# Altium schematic sheet Sheet1.SchDoc
size A2; SheetNumber: 1; SheetTotal: 1
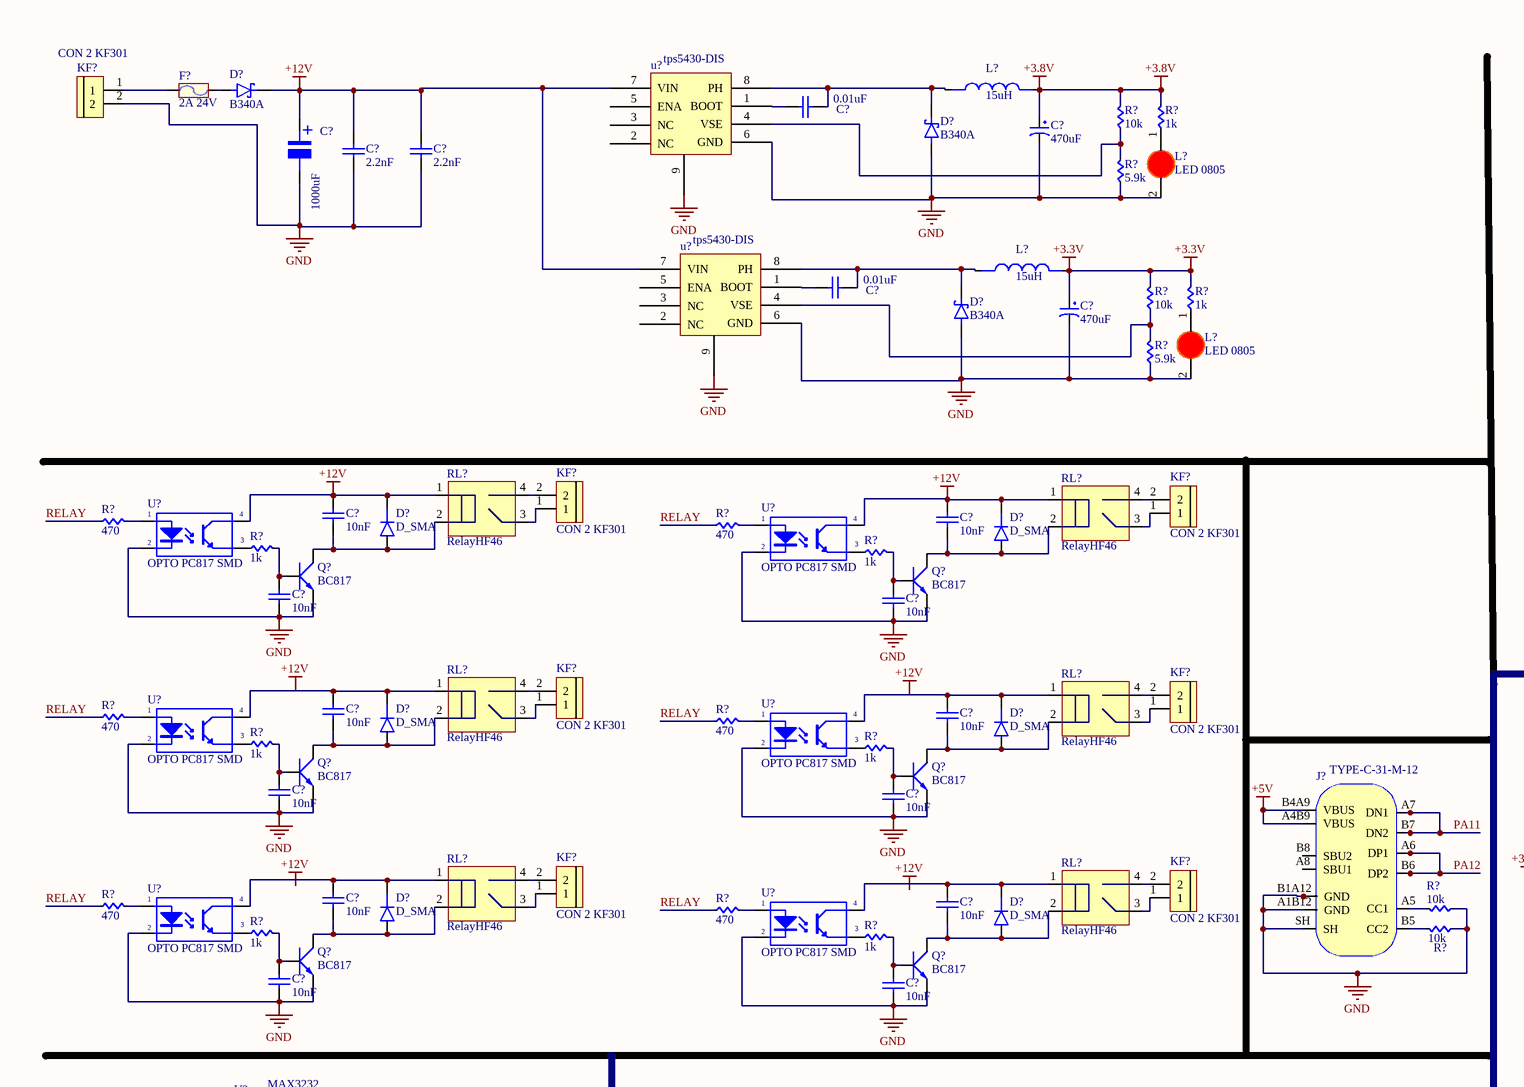
[diagram p0: Sheet1.SchDoc, top left]
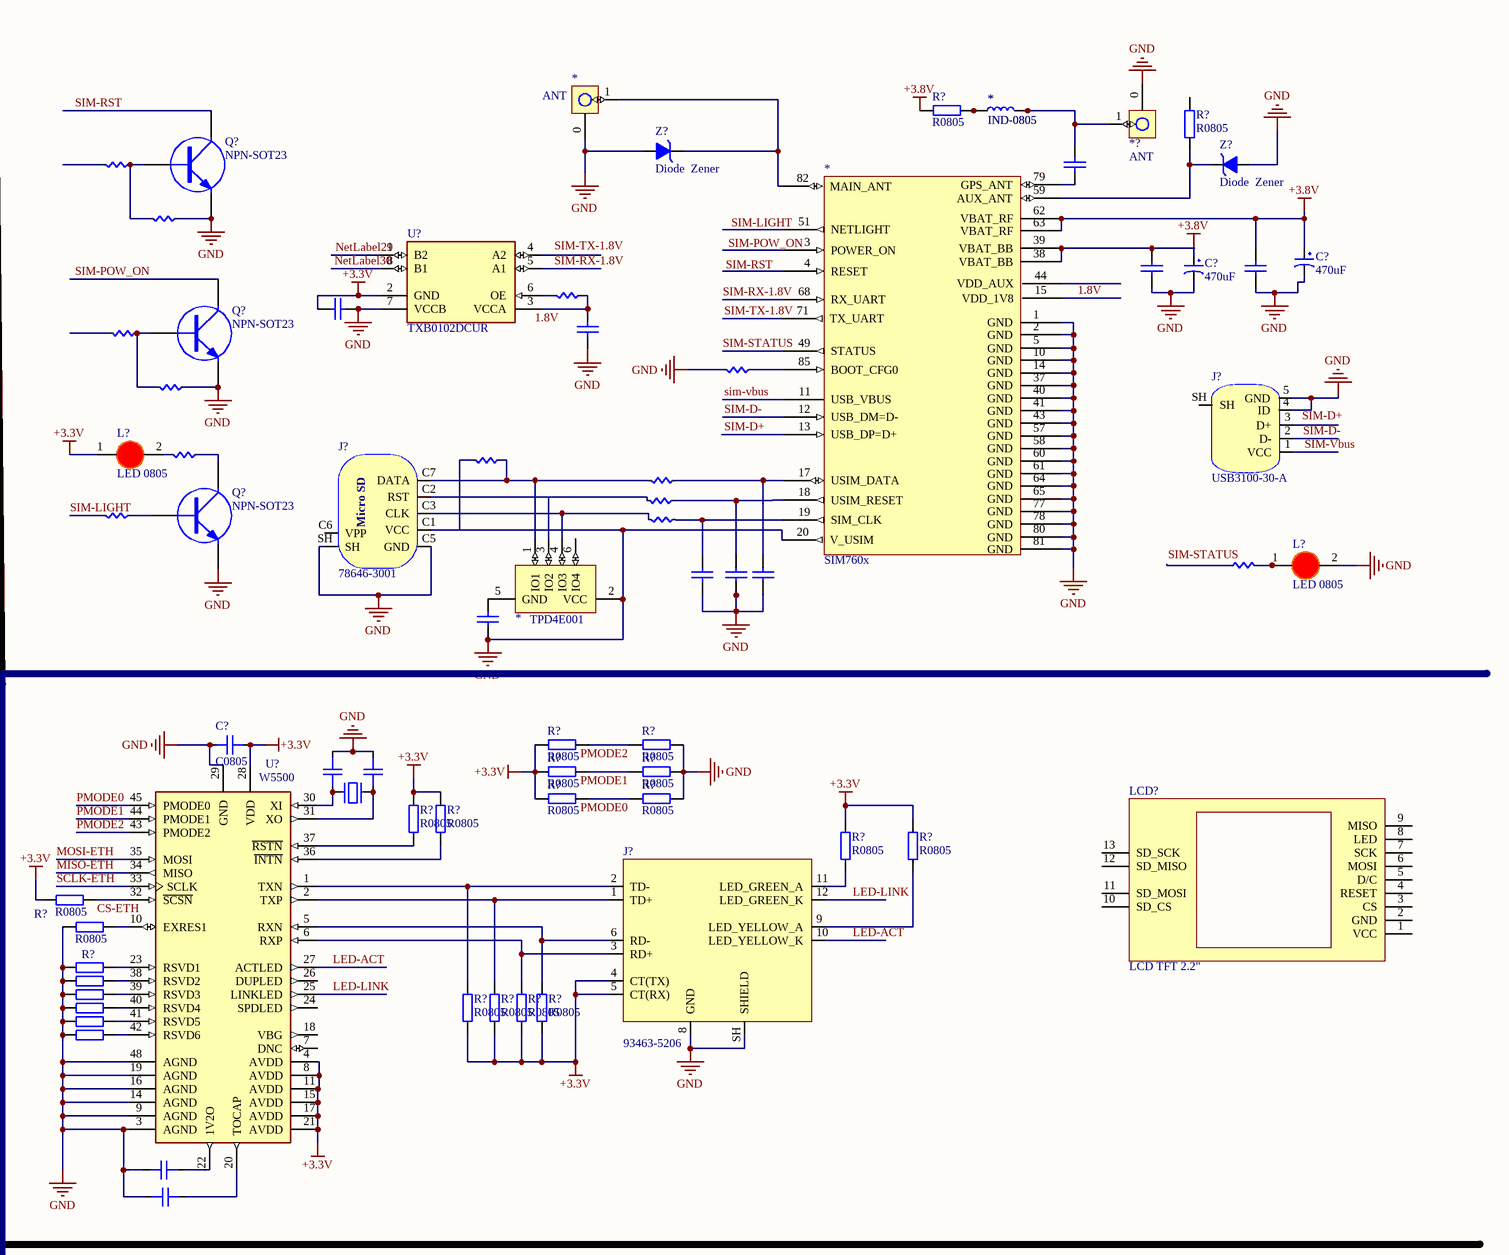
[diagram p1: Sheet1.SchDoc, top right]
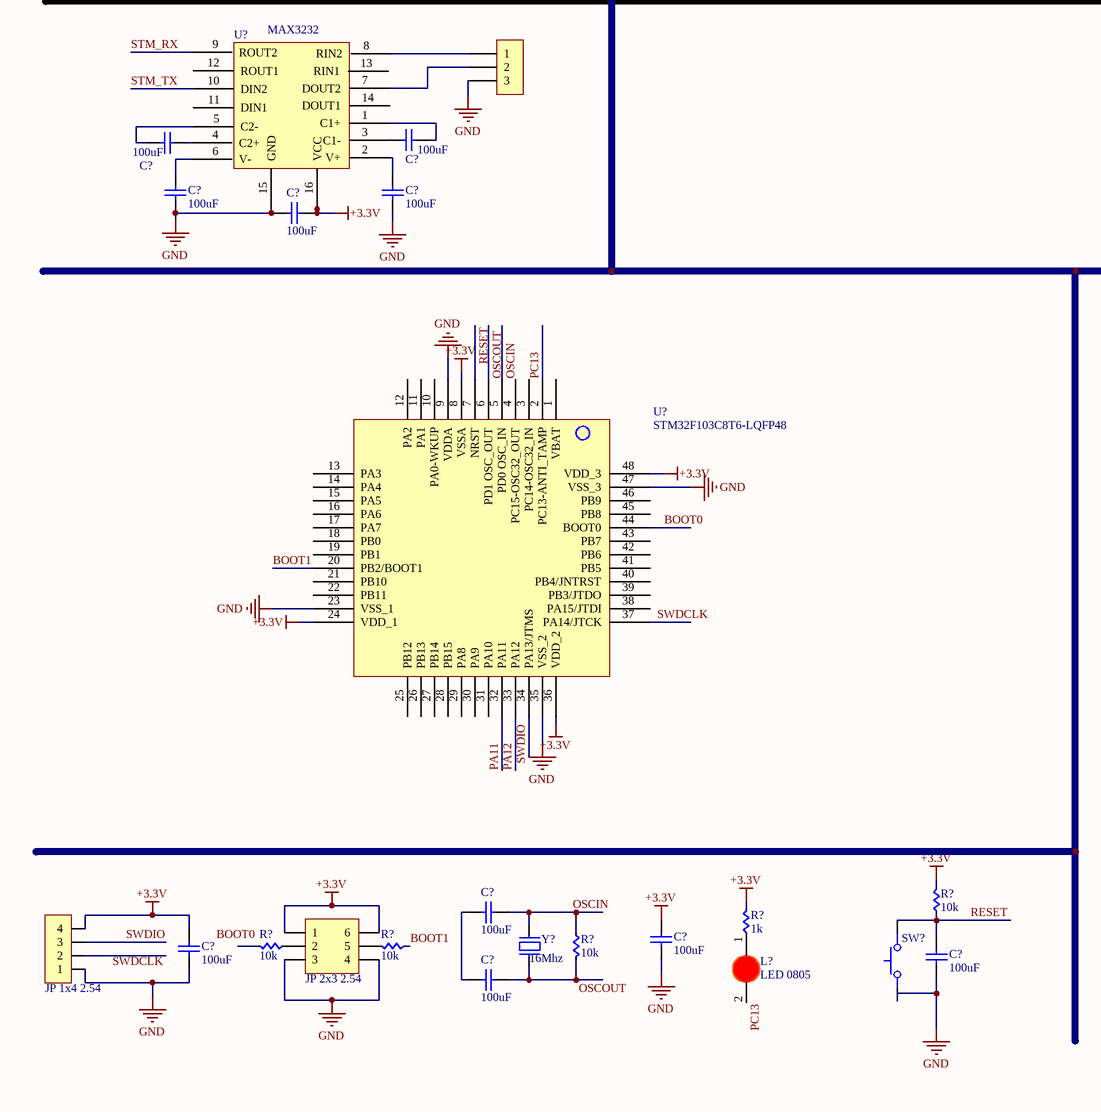
[diagram p2: Sheet1.SchDoc, bottom left]
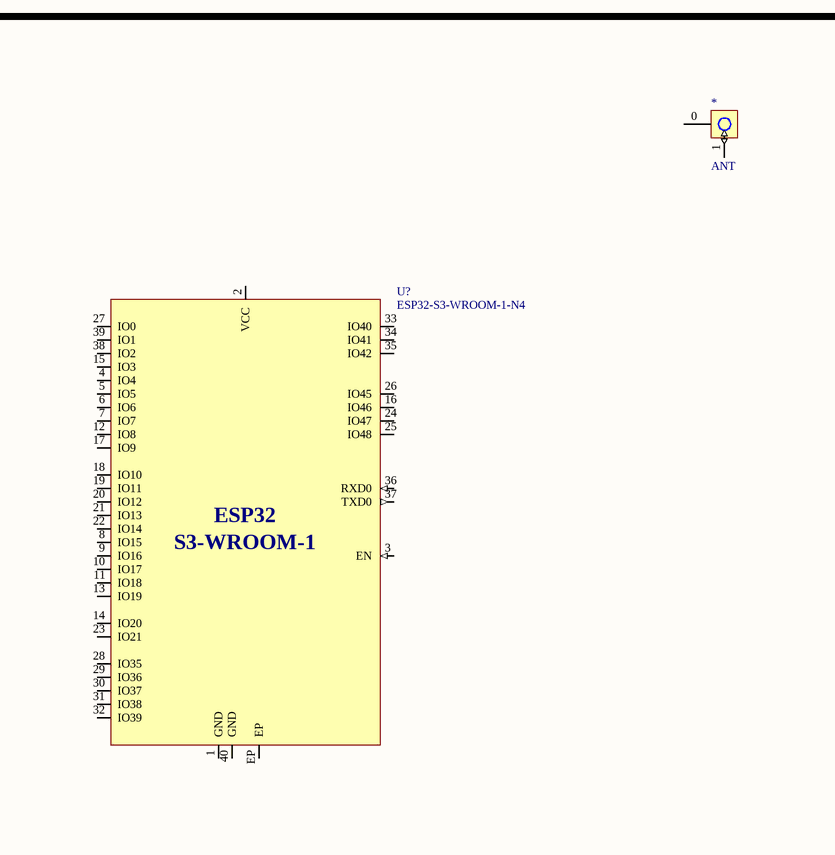
[diagram p3: Sheet1.SchDoc, bottom right]

## Parts
(Parts that share a designator on the sheet are numbered #1, #2 ... from top to bottom, then left to right.)
*#1  ANT  [ANTENNA SMA-KHD]
*#2  IND-0805  [INDUCTOR 0805]
*#3  IND-0805  [INDUCTOR 0805]
*#4  SIM760x  [SIM7600CE]
*#5  TPD4E001  [TSOT-26-6]
*#6  ANT  [ANTENNA SMA-KHD]
*?  ANT  [ANTENNA SMA-KHD]
C?#1  0.01uF  [tu 0805]
C?#2  470uF  [tu tantalum smd7343]
C?#3  1000uF  [tu nhom 10 (G)]
C?#4  2.2nF  [tu 0805]
C?#5  2.2nF  [tu 0805]
C?#6  0.01uF  [tu 0805]  (value not drawn)
C?#7  470uF  [tu tantalum smd7343]
C?#8  0.01uF  [tu 0805]  (value not drawn)
C?#9  470uF  [tu tantalum smd7343]
C?#10  0.01uF  [tu 0805]  (value not drawn)
C?#11  0.01uF  [tu 0805]
C?#12  0.01uF  [tu 0805]  (value not drawn)
C?#13  470uF  [tu tantalum smd7343]
C?#14  0.01uF  [tu 0805]  (value not drawn)
C?#15  10nF  [tu 0805]
C?#16  10nF  [tu 0805]
C?#17  0.01uF  [tu 0805]  (value not drawn)
C?#18  0.01uF  [tu 0805]  (value not drawn)
C?#19  0.01uF  [tu 0805]  (value not drawn)
C?#20  10nF  [tu 0805]
C?#21  10nF  [tu 0805]
C?#22  0.01uF  [tu 0805]  (value not drawn)
C?#23  10nF  [tu 0805]
C?#24  10nF  [tu 0805]
C?#25  C0805  [CAP_0805]
C?#26  C0805  [CAP_0805]  (value not drawn)
C?#27  C0805  [CAP_0805]  (value not drawn)
C?#28  10nF  [tu 0805]
C?#29  10nF  [tu 0805]
C?#30  10nF  [tu 0805]
C?#31  10nF  [tu 0805]
C?#32  10nF  [tu 0805]
C?#33  10nF  [tu 0805]
C?#34  C0805  [CAP_0805]  (value not drawn)
C?#35  100uF  [tu 0805]
C?#36  100uF  [tu 0805]
C?#37  C0805  [CAP_0805]  (value not drawn)
C?#38  100uF  [tu 0805]
C?#39  100uF  [tu 0805]
C?#40  100uF  [tu 0805]
C?#41  100uF  [tu 0805]
C?#42  100uF  [tu 0805]
C?#43  100uF  [tu 0805]
C?#44  100uF  [tu 0805]
C?#45  100uF  [tu 0805]
D?#1  B340A  [DIOM5226X240N]
D?#2  B340A  [DIOM5226X240N]
D?#3  B340A  [DIOM5226X240N]
D?#4  D_SMA  [DO-214AC-2 (SMA)]
D?#5  D_SMA  [DO-214AC-2 (SMA)]
D?#6  D_SMA  [DO-214AC-2 (SMA)]
D?#7  D_SMA  [DO-214AC-2 (SMA)]
D?#8  D_SMA  [DO-214AC-2 (SMA)]
D?#9  D_SMA  [DO-214AC-2 (SMA)]
F?  2A 24V  [Cau chi tu phuc hoi 2A 24V SMD1812]
H?  (no value)  [XH2.54M-3]
J?#1  USB3100-30-A  [USB3100-30-A]
J?#2  78646-3001  [78646-3001]
J?#3  TYPE-C-31-M-12  [TYPE-C-31-M-12]
J?#4  93463-5206  [lan]
JP?#1  JP 2x3 2.54  [JP 2x3 DT]
JP?#2  JP 1x4 2.54  [JP 1x4 DT]
KF?#1  CON 2 KF301  [Con 2 KF301 5.08]
KF?#2  CON 2 KF301  [Con 2 KF301 5.08]
KF?#3  CON 2 KF301  [Con 2 KF301 5.08]
KF?#4  CON 2 KF301  [Con 2 KF301 5.08]
KF?#5  CON 2 KF301  [Con 2 KF301 5.08]
KF?#6  CON 2 KF301  [Con 2 KF301 5.08]
KF?#7  CON 2 KF301  [Con 2 KF301 5.08]
L?#1  15uH  [CUON CAM SMD 0530]
L?#2  LED 0805  [LED-0805-Red]
L?#3  15uH  [CUON CAM SMD 0530]
L?#4  LED 0805  [LED-0805-Red]
L?#5  LED 0805  [LED-0805-Red]
L?#6  LED 0805  [LED-0805-Red]
L?#7  LED 0805  [LED-0805-Red]
LCD?  LCD TFT 2.2"  [LCD TFT 2.2"]
Q?#1  NPN-SOT23  [SOT23 - 3PIN]
Q?#2  NPN-SOT23  [SOT23 - 3PIN]
Q?#3  NPN-SOT23  [SOT23 - 3PIN]
Q?#4  BC817  [SOT-23]
Q?#5  BC817  [SOT-23]
Q?#6  BC817  [SOT-23]
Q?#7  BC817  [SOT-23]
Q?#8  BC817  [SOT-23]
Q?#9  BC817  [SOT-23]
R?#1  R0805  [RES_0805]
R?#2  R0805  [RES_0805]
R?#3  10k  [RES 0805]
R?#4  1k  [RES 0805]
R?#5  1k  [RES 0805]  (value not drawn)
R?#6  5.9k  [RES 0805]
R?#7  1k  [RES 0805]  (value not drawn)
R?#8  1k  [RES 0805]  (value not drawn)
R?#9  10k  [RES 0805]
R?#10  1k  [RES 0805]
R?#11  1k  [0805 RESISTOR]  (value not drawn)
R?#12  5.9k  [RES 0805]
R?#13  1k  [RES 0805]  (value not drawn)
R?#14  1k  [RES 0805]  (value not drawn)
R?#15  1k  [RES 0805]  (value not drawn)
R?#16  1k  [RES 0805]  (value not drawn)
R?#17  1k  [RES 0805]  (value not drawn)
R?#18  1k  [RES 0805]  (value not drawn)
R?#19  1k  [RES 0805]  (value not drawn)
R?#20  470  [RES 0805]
R?#21  470  [RES 0805]
R?#22  1k  [RES 0805]  (value not drawn)
R?#23  1k  [RES 0805]
R?#24  1k  [RES 0805]
R?#25  1k  [RES 0805]  (value not drawn)
R?#26  470  [RES 0805]
R?#27  470  [RES 0805]
R?#28  1k  [RES 0805]
R?#29  1k  [RES 0805]
R?#30  R0805  [RES_0805]
R?#31  R0805  [RES_0805]
R?#32  R0805  [RES_0805]
R?#33  R0805  [RES_0805]
R?#34  R0805  [RES_0805]
R?#35  R0805  [RES_0805]
R?#36  R0805  [RES_0805]
R?#37  R0805  [RES_0805]
R?#38  R0805  [RES_0805]
R?#39  R0805  [RES_0805]
R?#40  R0805  [RES_0805]
R?#41  470  [RES 0805]
R?#42  470  [RES 0805]
R?#43  10k  [RES 0805]
R?#44  10k  [RES 0805]
R?#45  R0805  [RES_0805]
R?#46  1k  [RES 0805]
R?#47  1k  [RES 0805]
R?#48  R0805  [RES_0805]  (value not drawn)
R?#49  R0805  [RES_0805]  (value not drawn)
R?#50  R0805  [RES_0805]  (value not drawn)
R?#51  R0805  [RES_0805]  (value not drawn)
R?#52  R0805  [RES_0805]
R?#53  R0805  [RES_0805]
R?#54  R0805  [RES_0805]
R?#55  R0805  [RES_0805]
R?#56  R0805  [RES_0805]  (value not drawn)
R?#57  R0805  [RES_0805]  (value not drawn)
R?#58  10k  [RES 0805]
R?#59  10k  [RES 0805]
R?#60  1k  [RES 0805]
R?#61  10k  [RES 0805]
R?#62  10k  [RES 0805]
RL?#1  RelayHF46  [Relay 4 chan HF46F]
RL?#2  RelayHF46  [Relay 4 chan HF46F]
RL?#3  RelayHF46  [Relay 4 chan HF46F]
RL?#4  RelayHF46  [Relay 4 chan HF46F]
RL?#5  RelayHF46  [Relay 4 chan HF46F]
RL?#6  RelayHF46  [Relay 4 chan HF46F]
SW?  DTSM-3  [DTSM-3]  (value not drawn)
u?#1  tps5430-DIS  [SOIC127P600X170_HS-8N]
U?#2  TXB0102DCUR  [txb0102]
u?#3  tps5430-DIS  [SOIC127P600X170_HS-8N]
U?#4  OPTO PC817 SMD  [PC817 SMD]
U?#5  OPTO PC817 SMD  [PC817 SMD]
U?#6  OPTO PC817 SMD  [PC817 SMD]
U?#7  OPTO PC817 SMD  [PC817 SMD]
U?#8  W5500  [w5500]
U?#9  OPTO PC817 SMD  [PC817 SMD]
U?#10  OPTO PC817 SMD  [PC817 SMD]
U?#11  MAX3232  [TSSOP 16PIN]
U?#12  STM32F103C8T6-LQFP48  [LQFP 48 PIN]
U?#13  ESP32-S3-WROOM-1-N4  [ESP32-S3-WROOM-1]
Y?#1  16Mhz  [Thach Anh 2 chan SMD]  (value not drawn)
Y?#2  16Mhz  [Thach Anh 2 chan SMD]
Z?#1  Diode  Zener  [DIODE ZENER SMD]
Z?#2  Diode  Zener  [DIODE ZENER SMD]

## Nets
+3.3V: C?#12.1 C?#13.1 C?#25.2 C?#40.1 C?#42.1 C?#43.1 J?#4.4(CT(TX)) J?#4.5(CT(RX)) JP?#1.1 JP?#1.6 JP?#2.4 L?#3.2 L?#5.1(A) R?#9.2 R?#10.2 R?#30.2 R?#32.2 R?#34.2 R?#36.2 R?#37.2 R?#38.2 R?#39.2 R?#40.2 R?#52.1 R?#53.1 R?#54.1 R?#55.1 R?#58.2 R?#60.2 U?#2.2(GND) U?#8.4(AVDD) U?#8.8(AVDD) U?#8.11(AVDD) U?#8.15(AVDD) U?#8.17(AVDD) U?#8.21(AVDD) U?#8.28(VDD) U?#11.16(VCC) U?#12.8(VSSA) U?#12.24(VDD_1) U?#12.36(VDD_2) U?#12.48(VDD_3)
+3.8V: *#4.62(VBAT_RF) *#4.63(VBAT_RF) C?#2.1 C?#7.1 C?#9.1 C?#10.1 L?#1.2 R?#1.1 R?#3.2 R?#4.2
+5V: J?#3.A4B9(VBUS) J?#3.B4A9(VBUS)
+12V: C?#3.1 C?#4.1 C?#5.1 C?#15.1 C?#16.1 C?#23.1 C?#24.1 D?#1.C D?#4.K D?#5.K D?#6.K D?#7.K RL?#1.1 RL?#2.1 RL?#3.1 RL?#4.1 u?#1.7(VIN) u?#3.7(VIN) U?#4.4(C) U?#5.4(C) U?#6.4(C) U?#7.4(C)
GND: *#1.0(GND) *#4.1(GND) *#4.2(GND) *#4.5(GND) *#4.10(GND) *#4.14(GND) *#4.20(V_USIM) *#4.37(GND) *#4.40(GND) *#4.41(GND) *#4.43(GND) *#4.57(GND) *#4.58(GND) *#4.60(GND) *#4.61(GND) *#4.64(GND) *#4.65(GND) *#4.77(GND) *#4.78(GND) *#4.80(GND) *#4.81(GND) *#5.2(VCC) *?.0(GND) C?#2.2 C?#3.2 C?#4.2 C?#5.2 C?#7.2 C?#8.2 C?#9.2 C?#10.2 C?#12.2 C?#13.2 C?#14.1 C?#17.2 C?#18.2 C?#19.2 C?#20.2 C?#21.2 C?#22.2 C?#25.1 C?#26.2 C?#27.2 C?#28.2 C?#29.2 C?#32.2 C?#33.2 C?#34.2 C?#37.2 C?#38.1 C?#39.1 C?#40.2 C?#42.2 C?#43.2 C?#44.2 D?#2.A D?#3.A H?.3 J?#1.4(ID) J?#1.5(GND) J?#2.C1(VCC) J?#2.C5(GND) J?#2.SH J?#3.A1B12(GND) J?#3.B1A12(GND) J?#3.SH J?#4.8(GND) J?#4.SH(SHIELD) JP?#1.3 JP?#1.4 JP?#2.1 KF?#1.2 L?#2.2(K) L?#4.2(K) L?#6.2(K) Q?#1.2(E) Q?#2.2(E) Q?#3.2(E) Q?#4.2(E) Q?#5.2(E) Q?#6.2(E) Q?#7.2(E) Q?#8.2(E) Q?#9.2(E) R?#6.1 R?#7.1 R?#12.1 R?#13.2 R?#14.1 R?#31.1 R?#33.1 R?#35.1 R?#43.1 R?#44.1 R?#45.2 R?#48.1 R?#49.1 R?#50.1 R?#51.1 R?#56.1 R?#57.1 SW?.1 u?#1.6(GND) u?#1.9 U?#2.7(VCCB) u?#3.6(GND) u?#3.9 U?#4.2(K) U?#5.2(K) U?#6.2(K) U?#7.2(K) U?#8.3(AGND) U?#8.9(AGND) U?#8.14(AGND) U?#8.16(AGND) U?#8.19(AGND) U?#8.29(GND) U?#8.48(AGND) U?#9.2(K) U?#10.2(K) U?#11.15(GND) U?#12.9(VDDA) U?#12.23(VSS_1) U?#12.35(VSS_2) U?#12.47(VSS_3) Z?#1.1(A) Z?#2.1(A)
1.8V: *#4.15(VDD_1V8) C?#14.2 R?#8.1 U?#2.3(VCCA)
BOOT0: U?#12.44(BOOT0)
BOOT1: R?#62.1 U?#12.20(PB2/BOOT1)
CS-ETH: R?#40.1 U?#8.32(~{SCSN})
LED-ACT: J?#4.10(LED_YELLOW_K) U?#8.27(ACTLED)
LED-LINK: J?#4.12(LED_GREEN_K) U?#8.25(LINKLED)
MISO-ETH: U?#8.34(MISO)
MOSI-ETH: U?#8.35(MOSI)
NetLabel29: U?#2.1(B2)
NetLabel30: U?#2.8(B1)
OSCIN: U?#12.5(PD0_OSC_IN)
OSCOUT: C?#45.2 R?#59.2 U?#12.6(PD1_OSC_OUT) Y?#2.1
PA11: J?#3.A7(DN1) J?#3.B7(DN2) U?#12.32(PA11)
PA12: J?#3.A6(DP1) J?#3.B6(DP2) U?#12.33(PA12)
PC13: L?#7.2(K) U?#12.2(PC13-ANTI_TAMP)
PMODE0: R?#34.1 R?#35.2 U?#8.45(PMODE0)
PMODE1: R?#32.1 R?#33.2 U?#8.44(PMODE1)
PMODE2: R?#30.1 R?#31.2 U?#8.43(PMODE2)
RELAY: R?#20.1 R?#21.1 R?#26.1 R?#27.1 R?#41.1 R?#42.1
RESET: C?#44.1 R?#58.1 SW?.2 U?#12.7(NRST)
SCLK-ETH: U?#8.33(SCLK)
SIM-D+: *#4.13(USB_DP=D+)
SIM-D-: *#4.12(USB_DM=D-) J?#1.2(D-)
SIM-LIGHT: R?#19.2
SIM-POW_ON: Q?#2.3(C)
SIM-RST: Q?#1.3(C)
SIM-RX-1.8V: *#4.68(RX_UART) U?#2.5(A1)
SIM-STATUS: *#4.49(STATUS)
SIM-TX-1.8V: *#4.71(TX_UART)
sim-vbus: *#4.11(USB_VBUS) J?#1.1(VCC)
STM_RX: U?#11.9(ROUT2)
STM_TX: U?#11.10(DIN2)
SWDCLK: U?#12.37(PA14/JTCK)
SWDIO: JP?#2.3 U?#12.34(PA13/JTMS)
Net*#1_1: *#1.1 *#4.82(MAIN_ANT) Z?#1.2(K)
Net*#2_1: *#2.1 *#3.1 R?#1.2
Net*#2_2: *#2.2 *#3.2 *?.1 C?#6.2
Net*#4_17: *#4.17(USIM_DATA) C?#19.1 R?#17.1
Net*#4_18: *#4.18(USIM_RESET) C?#18.1 R?#18.1
Net*#4_19: *#4.19(SIM_CLK) C?#17.1 R?#22.1
Net*#4_38: *#4.38(VBAT_BB) *#4.39(VBAT_BB) C?#8.1
Net*#4_59: *#4.59(AUX_ANT) R?#2.1 Z?#2.2(K)
Net*#4_79: *#4.79(GPS_ANT) C?#6.1
Net*#4_85: *#4.85(BOOT_CFG0) R?#13.1
Net*#5_1: *#5.1(IO1) J?#2.C7(DATA) R?#16.1 R?#17.2
Net*#5_3: *#5.3(IO2) J?#2.C2(RST) R?#18.2
Net*#5_4: *#5.4(IO3) J?#2.C3(CLK) R?#22.2
Net*#5_5: *#5.5(GND) C?#22.1
NetC?#1_1: C?#1.1 D?#2.C L?#1.1 u?#1.8(PH)
NetC?#1_2: C?#1.2 u?#1.1(BOOT)
NetC?#11_1: C?#11.1 D?#3.C L?#3.1 u?#3.8(PH)
NetC?#11_2: C?#11.2 u?#3.1(BOOT)
NetC?#15_2: C?#15.2 D?#4.A Q?#4.3(C) RL?#1.2
NetC?#16_2: C?#16.2 D?#5.A Q?#5.3(C) RL?#2.2
NetC?#20_1: C?#20.1 Q?#4.1(B) R?#23.2
NetC?#21_1: C?#21.1 Q?#5.1(B) R?#24.2
NetC?#23_2: C?#23.2 D?#6.A Q?#6.3(C) RL?#3.2
NetC?#24_2: C?#24.2 D?#7.A Q?#7.3(C) RL?#4.2
NetC?#26_1: C?#26.1 U?#8.30(XI) Y?#1.1
NetC?#27_1: C?#27.1 U?#8.31(XO) Y?#1.2
NetC?#28_1: C?#28.1 Q?#6.1(B) R?#28.2
NetC?#29_1: C?#29.1 Q?#7.1(B) R?#29.2
NetC?#30_1: C?#30.1 D?#8.K RL?#5.1 U?#9.4(C)
NetC?#30_2: C?#30.2 D?#8.A Q?#8.3(C) RL?#5.2
NetC?#31_1: C?#31.1 D?#9.K RL?#6.1 U?#10.4(C)
NetC?#31_2: C?#31.2 D?#9.A Q?#9.3(C) RL?#6.2
NetC?#32_1: C?#32.1 Q?#8.1(B) R?#46.2
NetC?#33_1: C?#33.1 Q?#9.1(B) R?#47.2
NetC?#34_1: C?#34.1 U?#8.22(1V2O)
NetC?#35_1: C?#35.1 U?#11.4(C2+)
NetC?#35_2: C?#35.2 U?#11.5(C2-)
NetC?#36_1: C?#36.1 U?#11.1(C1+)
NetC?#36_2: C?#36.2 U?#11.3(C1-)
NetC?#37_1: C?#37.1 U?#8.20(TOCAP)
NetC?#38_2: C?#38.2 U?#11.6(V-)
NetC?#39_2: C?#39.2 U?#11.2(V+)
NetC?#41_1: C?#41.1 C?#45.1
NetC?#41_2: C?#41.2 R?#59.1 Y?#2.2
NetD?#1_A: D?#1.A F?.2
NetF?_1: F?.1 KF?#1.1
NetH?_1: H?.1 U?#11.8(RIN2)
NetH?_2: H?.2 U?#11.7(DOUT2)
NetJ?#3_A5: J?#3.A5(CC1) R?#43.2
NetJ?#3_B5: J?#3.B5(CC2) R?#44.2
NetJ?#4_1: J?#4.1(TD+) R?#53.2 U?#8.2(TXP)
NetJ?#4_2: J?#4.2(TD-) R?#52.2 U?#8.1(TXN)
NetJ?#4_3: J?#4.3(RD+) R?#54.2 U?#8.6(RXP)
NetJ?#4_6: J?#4.6(RD-) R?#55.2 U?#8.5(RXN)
NetJ?#4_9: J?#4.9(LED_YELLOW_A) R?#39.1
NetJ?#4_11: J?#4.11(LED_GREEN_A) R?#38.1
NetJP?#1_2: JP?#1.2 R?#61.1
NetJP?#1_5: JP?#1.5 R?#62.2
NetKF?#2_1: KF?#2.1 RL?#1.3(AC/DC)
NetKF?#2_2: KF?#2.2 RL?#1.4(AC/DC)
NetKF?#3_1: KF?#3.1 RL?#2.3(AC/DC)
NetKF?#3_2: KF?#3.2 RL?#2.4(AC/DC)
NetKF?#4_1: KF?#4.1 RL?#3.3(AC/DC)
NetKF?#4_2: KF?#4.2 RL?#3.4(AC/DC)
NetKF?#5_1: KF?#5.1 RL?#4.3(AC/DC)
NetKF?#5_2: KF?#5.2 RL?#4.4(AC/DC)
NetKF?#6_1: KF?#6.1 RL?#5.3(AC/DC)
NetKF?#6_2: KF?#6.2 RL?#5.4(AC/DC)
NetKF?#7_1: KF?#7.1 RL?#6.3(AC/DC)
NetKF?#7_2: KF?#7.2 RL?#6.4(AC/DC)
NetL?#2_1: L?#2.1(A) R?#4.1
NetL?#4_1: L?#4.1(A) R?#10.1
NetL?#5_2: L?#5.2(K) R?#15.2
NetL?#6_1: L?#6.1(A) R?#25.2
NetL?#7_1: L?#7.1(A) R?#60.1
NetQ?#1_1: Q?#1.1(B) R?#5.1 R?#7.2
NetQ?#2_1: Q?#2.1(B) R?#11.1 R?#14.2
NetQ?#3_1: Q?#3.1(B) R?#19.1
NetQ?#3_3: Q?#3.3(C) R?#15.1
NetR?#3_1: R?#3.1 R?#6.2 u?#1.4(VSE)
NetR?#8_2: R?#8.2 U?#2.6(OE)
NetR?#9_1: R?#9.1 R?#12.2 u?#3.4(VSE)
NetR?#20_2: R?#20.2 U?#4.1(A)
NetR?#21_2: R?#21.2 U?#5.1(A)
NetR?#23_1: R?#23.1 U?#4.3(E)
NetR?#24_1: R?#24.1 U?#5.3(E)
NetR?#26_2: R?#26.2 U?#6.1(A)
NetR?#27_2: R?#27.2 U?#7.1(A)
NetR?#28_1: R?#28.1 U?#6.3(E)
NetR?#29_1: R?#29.1 U?#7.3(E)
NetR?#36_1: R?#36.1 U?#8.37(~{RSTN})
NetR?#37_1: R?#37.1 U?#8.36(~{INTN})
NetR?#41_2: R?#41.2 U?#9.1(A)
NetR?#42_2: R?#42.2 U?#10.1(A)
NetR?#45_1: R?#45.1 U?#8.10(EXRES1)
NetR?#46_1: R?#46.1 U?#9.3(E)
NetR?#47_1: R?#47.1 U?#10.3(E)
NetR?#48_2: R?#48.2 U?#8.23(RSVD1)
NetR?#49_2: R?#49.2 U?#8.38(RSVD2)
NetR?#50_2: R?#50.2 U?#8.39(RSVD3)
NetR?#51_2: R?#51.2 U?#8.40(RSVD4)
NetR?#56_2: R?#56.2 U?#8.41(RSVD5)
NetR?#57_2: R?#57.2 U?#8.42(RSVD6)

Not connected (* = marked no-connect by the designer): *#4 3(POWER_ON) 4(RESET) 44(VDD_AUX) 51(NETLIGHT); *#5 6(IO4); *#6 0(GND) 1; J?#1 3(D+) SH; J?#2 C6(VPP); J?#3 A8(SBU1) B8(SBU2); JP?#2 2; LCD? 1(VCC) 2(GND) 3(CS) 4(RESET) 5(D/C) 6(MOSI) 7(SCK) 8(LED) 9(MISO) 10(SD_CS) 11(SD_MOSI) 12(SD_MISO) 13(SD_SCK); R?#2 2; R?#5 2; R?#11 2; R?#16 2; R?#25 1; R?#61 2; u?#1 2(NC) 3(NC) 5(ENA); U?#2 4(A2); u?#3 2(NC) 3(NC) 5(ENA); U?#8 7(DNC) 18(VBG) 24(SPDLED) 26(DUPLED); U?#11 11(DIN1) 12(ROUT1) 13(RIN1) 14(DOUT1); U?#12 1(VBAT) 3(PC14-OSC32_IN) 4(PC15-OSC32_OUT) 10(PA0-WKUP) 11(PA1) 12(PA2) 13(PA3) 14(PA4) 15(PA5) 16(PA6) 17(PA7) 18(PB0) 19(PB1) 21(PB10) 22(PB11) 25(PB12) 26(PB13) 27(PB14) 28(PB15) 29(PA8) 30(PA9) 31(PA10) 38(PA15/JTDI) 39(PB3/JTDO) 40(PB4/JNTRST) 41(PB5) 42(PB6) 43(PB7) 45(PB8) 46(PB9); U?#13 1(GND) 2(VCC) 3(EN) 4(IO4) 5(IO5) 6(IO6) 7(IO7) 8(IO15) 9(IO16) 10(IO17) 11(IO18) 12(IO8) 13(IO19) 14(IO20) 15(IO3) 16(IO46) 17(IO9) 18(IO10) 19(IO11) 20(IO12) 21(IO13) 22(IO14) 23(IO21) 24(IO47) 25(IO48) 26(IO45) 27(IO0) 28(IO35) 29(IO36) 30(IO37) 31(IO38) 32(IO39) 33(IO40) 34(IO41) 35(IO42) 36(RXD0) 37(TXD0) 38(IO2) 39(IO1) 40(GND) EP

## Notes on the sheet
- Labels drawn without touching a wire or pin: +12V, BOOT0, OSCIN, SIM-D+, SIM-LIGHT, SIM-POW_ON, SIM-RST, SIM-STATUS, SIM-TX-1.8V, SWDCLK
- (in symbol ESP32-S3-WROOM-1-N4) ESP32; S3-WROOM-1
- (in symbol micro-sim) Micro SD
- (in symbol Tu Nhom 1000uF 16V) +

## Library data of the parts
C?#1 C?#6 C?#8 C?#10-C?#12 C?#14 C?#17-C?#19 C?#22 C?#35 C?#36 C?#38-C?#45 = Tu 0805 15pF 50V 10%: Dán; Don_Vi: Con; So_Chan: 2; Ten_Linh_Kien: Tụ 0805 15P 10% 50V; Ma_Hang: MH004556; Chung_Loai: Dán; Kieu_Chan: *
C?#2 C?#7 C?#9 C?#13 = Tu tantalum 470uF 10V SMD7343: Dán; Don_Vi: Con; So_Chan: 2; Ten_Linh_Kien: Tụ tantalum 477A-470uF 10V SMD7343; Ma_Hang: MH001956; Chung_Loai: Dán; Kieu_Chan: *
C?#3 = Tu Nhom 1000uF 16V: Dán; Don_Vi: Con; So_Chan: 2; Ten_Linh_Kien: Tụ Nhôm 1000uF 16V 10x10MM; Ma_Hang: MH004419; Chung_Loai: Dán; Kieu_Chan: *
C?#4 C?#5 C?#15 C?#16 C?#20 C?#21 C?#23 C?#24 C?#28-C?#33 = Tu 0805 22nF 50V 20%: Dán; Don_Vi: Con; So_Chan: 2; Ten_Linh_Kien: Tụ 0805 22nF 50V 20%; Ma_Hang: MH007857; Chung_Loai: Dán; Kieu_Chan: *
C?#25-C?#27 C?#34 C?#37 = CAP_0805: Capacitor SMD 0805; Manufacturer: *; Manufacturer Part Number: *; Distributor Link: *; LCSC: *; Rating: *; Dielectric: *
D?#1-D?#3 = B340A-13-F: Diode Schottky 40V 3A Surface Mount SMA; MF: Diodes Inc.; Availability: Unavailable; MP: B340A-13-F; Price: None; Value: *; SnapEDA_Link: https://www.snapeda.com/parts/B340A-13-F/Diodes%20Inc./view-part/78704/?ref=snap; Package: DO-214 Diodes Inc.
D?#4-D?#9 = D_SMA: Diode SMD SMA (DO-214AA)
F? = Cau chi tu phuc hoi 2A 24V SMD1812: 2A 24V SMD1812; Ma_Hang: MH010033; Ten: Cầu Chì Tự Phục Hồi 2A 24V SMD1812
H? = Header 3P 2.54 Duc Thang: Cắm; Ten_Linh_Kien: Header 3P XH2.54-3P Đực Thẳng; Don_Vi: Con; Ma_Hang: MH001292; Chung_Loai: Cắm
J?#1 = USB3100-30-A: USB Connector Type Micro B 2.0 SMD Reverse Mount; Manufacturer: GCT; Manufacturer Part Number: USB3100-30-A
J?#2 = micro-sim: micro-SIM Card Socket without Detect Switch, 1.45mm Height, Push-Pull Eject, Surface Mount, 6 Circuits, Low-Halogen, Lead-Free; Manufacturer: Molex; Manufacturer Part Number: 78646-3001
J?#3 = TYPE-C-31-M-12: USB Type C Connector Horizontal SMT; Manufacturer: Koren Hroparts; Manufacturer Part Number: TYPE-C-31-M-12
J?#4 = enthernet: MXMag Gigabit Ethernet 8 Core Non-PoE Single-Port RJ45 Connector, 21.40mm Depth, 3.30mm Phy Pin Length, Right-Angle, Inverted Profile, with Shield Tabs, with Green-Green LEDs, Standard Temperature, with 2kV Shield Connection, Tray; Manufacturer: Molex; Manufacturer Part Number: 93463-5206
JP?#1 = JP 2x3 2.54 Duc Thang: Cắm; Ten_Linh_Kien: Jump Đôi Đực 2.54MM 2x40P Thẳng 11MM; Don_Vi: Con; Ma_Hang: MH002686; Ghi_Chu: *; Kieu_Chan: *; Chung_Loai: Cắm
JP?#2 = JP 1x4 2.54 Duc Thang: Cắm; Ten_Linh_Kien: Jump Đơn Đực 2.54MM 1x40P Thẳng 11MM; Don_Vi: Con; Ma_Hang: MH000903; Ghi_Chu: *; Kieu_Chan: *; Chung_Loai: Cắm
KF?#1-KF?#7 = CON 2 KF301: Cắm; Ma_Hang: MH000987; Ten_Linh_Kien: CON 2 KF301-2P 5.08MM Xanh Dương; Chung_Loai: Cắm; Ghi_Chu: *; Kieu_Chan: *; Don_Vi: Con
L?#1 L?#3 = Cuon Cam SMD 0530: SMD 0530; MP: FDV0530-H-1R5M=P3; Package: None; Price: None; Value: *; Availability: Unavailable
L?#2 L?#4-L?#7 = LED 0805 Do: Dán; Don_Vi: Con; Ma_Hang: MH000897; Ten_Linh_Kien: LED 0805 Màu Đỏ (Red); Ghi_Chu: *; Kieu_Chan: *; Chung_Loai: Dán
Q?#4-Q?#9 = Trans BC817: SOT-23 - C8658; Value: C9014
R?#1 R?#2 R?#30-R?#40 R?#45 R?#48-R?#57 = RES_0805: Resistor SMD 0805; Manufacturer: *; Manufacturer Part Number: *; Distributor Link: *; LCSC: *
R?#3 R?#9 R?#43 R?#44 R?#58 R?#59 R?#61 R?#62 = RES 0805: RES SMD 0805; Manufacturer: Vishay Dale; Manufacturer Part Number: CRCW040210K0FKED; Tolerance: ±1%; Power (Watts): 0.063W, 1/16W; Temperature Coefficient: ±100ppm/°C; Supplier 1: Digi-Key; RoHS: RoHS Compliant; Category: Resistors; Stock 1: 2392462; Pricing 1: 10=0.083, 50=0.0444, 200=0.0255, 1000=0.0174 (USD); Packaging: Cut Tape (CT); Resistance (Ohms): 10k; Composition: Thick Film; Features: Automotive AEC-Q200; Operating Temperature: -55°C ~ 155°C; Package / Case: 0402 (1005 Metric); Supplier Device Package: 0402 (1005 Metric); Size / Dimension: 0.039" L x 0.020" W (1.00mm x 0.50mm); Height: 0.016" (0.40mm); Number of Terminations: 2; ComponentLink1URL: http://www.vishay.com/docs/20035/dcrcwe3.pdf; ComponentLink1Description: http://www.vishay.com/docs/20035/dcrcwe3.pdf; Supplier Part Number 1: 541-10.0KLCT-ND
R?#4-R?#8 R?#10-R?#29 R?#41 R?#42 R?#46 R?#47 R?#60 = RES 0805: RES SMD 0805; Manufacturer: Vishay Dale; Manufacturer Part Number: CRCW040210K0FKED; Resistance (Ohms): 10k; Tolerance: ±1%; Power (Watts): 0.063W, 1/16W; Temperature Coefficient: ±100ppm/°C; Supplier 1: Digi-Key; RoHS: RoHS Compliant; Category: Resistors; Stock 1: 2392462; Pricing 1: 10=0.083, 50=0.0444, 200=0.0255, 1000=0.0174 (USD); Packaging: Cut Tape (CT); Composition: Thick Film; Features: Automotive AEC-Q200; Operating Temperature: -55°C ~ 155°C; Package / Case: 0402 (1005 Metric); Supplier Device Package: 0402 (1005 Metric); Size / Dimension: 0.039" L x 0.020" W (1.00mm x 0.50mm); Height: 0.016" (0.40mm); Number of Terminations: 2; ComponentLink1URL: http://www.vishay.com/docs/20035/dcrcwe3.pdf; ComponentLink1Description: http://www.vishay.com/docs/20035/dcrcwe3.pdf; Supplier Part Number 1: 541-10.0KLCT-ND
RL?#1-RL?#6 = Relay 4 chan HF46F: Ten: Relay 5V5A HF46F-G 5-HS1; Ma_Hang: MH003879
SW? = DTSM-3: Tactile Switch SMD SPST; Manufacturer: Diptronics; Manufacturer Part Number: DTSM-3
U?#2 = TXB0102DCUR: 2-Bit Bidirectional Voltage-Level Shifter with Auto Direction Sensing and +/-15-kV ESD Protect 8-VSSOP -40 to 85; MF: Texas Instruments; Digi-Key_Part_Number: 296-22862-1-ND; MP: TXB0102DCUR; Value: *; SnapEDA_Link: https://www.snapeda.com/parts/TXB0102DCUR/Texas%20Instruments/view-part/350005/?ref=snap; DigiKey-Purchase-URL: https://snapeda.com/shop?store=DigiKey&id=350005; Package: VSSOP-8 Texas Instruments; Texas_Instruments-Purchase-URL: https://snapeda.com/shop?store=Texas+Instruments&id=350005; Mouser-Purchase-URL: https://snapeda.com/shop?store=Mouser&id=350005
U?#4-U?#7 U?#9 U?#10 = OPTO PC817 SMD: Single Opto; Value: PC817
U?#8 = W5500: Hardwired TCP/IP embedded Ethernet controller; Availability: Unavailable; MP: W5500; Value: *; Price: None; Package: None
U?#13 = ESP32-S3-WROOM-1-N4: 2.4 GHz Wi-Fi (802.11 b/g/n) and Bluetooth 5 (LE) Module ESP32-S3, 4MB Flash, on-board PCB antenna); Manufacturer: Espressif; Manufacturer Part Number: ESP32-S3-WROOM-1-N4; Distributor Link: https://www.mouser.de/ProductDetail/Espressif-Systems/ESP32-S3-WROOM-1-N4?qs=Li%252BoUPsLEnsO%2FkiJOUK0FQ%3D%3D
Y?#1 Y?#2 = Thach Anh 2 chan SMD: Crystal For all Crystal 2pin.; Value: 4Mhz
Z?#1 Z?#2 = Diode Zener
U?#12 = STM32F103C8T6-LQFP48: Published: 30-May-2008; DatasheetVersion: rev6, Mar-2008; PackageVersion: Mar-2008; PackageReference: LQFP48; Publisher: Altium Limited; PackageDescription: 48-Pin Low-Profile Quad Flat Pack, 7 x 7 mm Body, 0.5 mm Pitch (LQFP48); ComponentLink1Description: Manufacturer Link; ComponentLink1URL: www.st.com/stm32; ComponentLink2Description: Datasheet; ComponentLink2URL: http://www.st.com/stonline/products/literature/ds/13586.pdf